# EAGLE schematic anemometer-r4 (EAGLE 9.4.0)
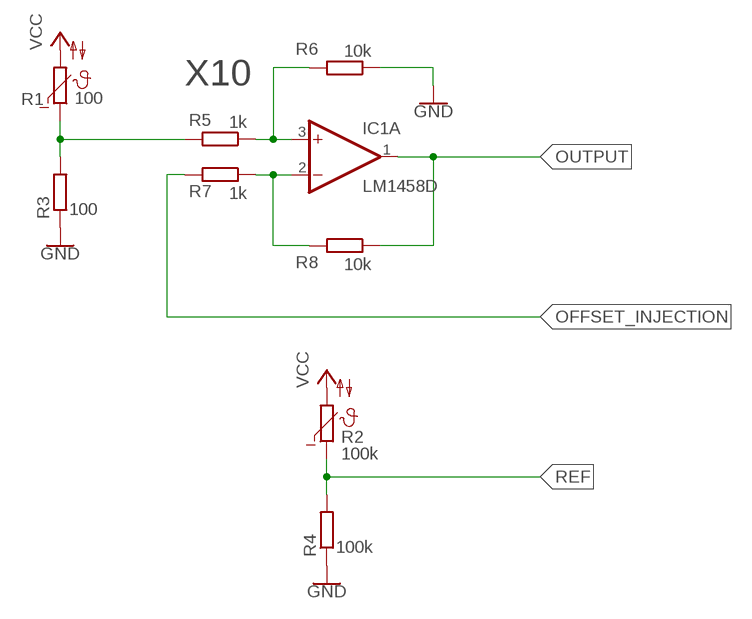
[diagram p0: schematic, sheet 1]

## Parts
IC1  LM1458D  [SO08]
R1  100  NTC640-9  [N640]
R2  100k  NTC640-9  [N640]
R3  100  R-EU_0414/5V  [0414V]
R4  100k  R-EU_0414/5V  [0414V]
R5  1k  R-EU_0414/5V  [0414V]
R6  10k  R-EU_0414/5V  [0414V]
R7  1k  R-EU_0414/5V  [0414V]
R8  10k  R-EU_0414/5V  [0414V]

## Nets
GND: R3.1 R4.1 R6.1
N$2: R1.1 R3.2 R5.2
N$3: IC1.3(A:+IN) R5.1 R6.2
N$5: IC1.2(A:-IN) R7.1 R8.2
OFFSET_INJECTION: R7.2
OUTPUT: IC1.1(A:OUT) R8.1
REF: R2.1 R4.2
VCC: R1.2 R2.2
Unconnected: IC1.5(B:+IN) IC1.6(B:-IN) IC1.7(B:OUT)

## Notes on the sheet
- X10

## Power pins joined to a net without a drawn wire
V+: IC1.8(P:V+)
V-: IC1.4(P:V-)

## Library data of the parts
IC1 = linear:*1458: OP AMP
R1 R2 = ptc-ntc:NTC640-9: PHILIPS NTC; OC_FARNELL: unknown; OC_NEWARK: unknown
R3-R8 = rcl:R-EU_: RESISTOR, European symbol; SPICEPREFIX: R